# EAGLE schematic PowerSource (EAGLE 9.2.2)
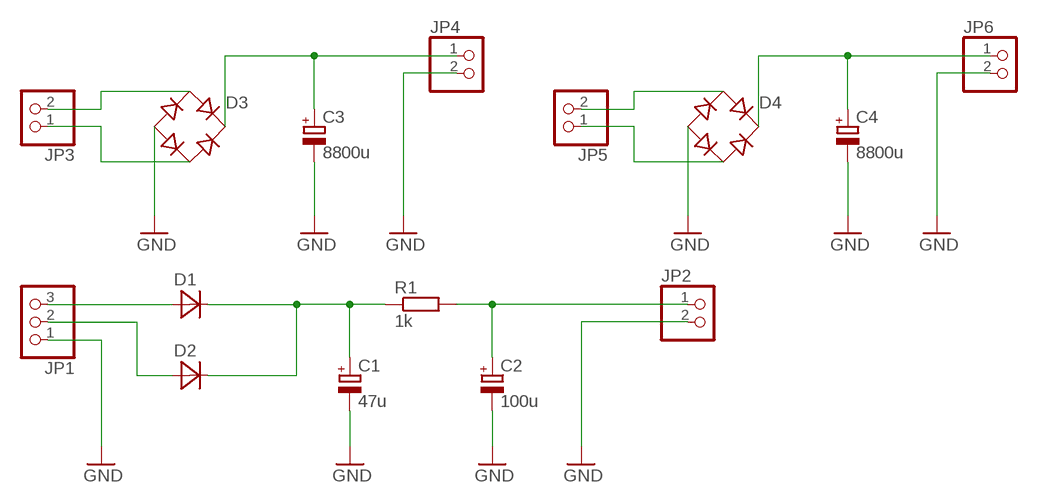
[diagram p0: schematic, sheet 1]

## Parts
C1  47u  E7.5-16  [E7,5-16]
C2  100u  E7.5-18  [E7,5-18]
C3  8800u  E7.5-18  [E7,5-18]
C4  8800u  E7.5-18  [E7,5-18]
D1  DIODE  [DO07]
D2  DIODE  [DO07]
D3  BRIDGERECTIFIER  [BRIDGERECTIFIER]
D4  BRIDGERECTIFIER  [BRIDGERECTIFIER]
JP1  PINHD-1X3  [1X03]
JP2  PINHD-1X2  [1X02]
JP3  PINHD-1X2  [1X02]
JP4  PINHD-1X2  [1X02]
JP5  PINHD-1X2  [1X02]
JP6  PINHD-1X2  [1X02]
R1  1k  RESISTOR2  [0207/7]

## Nets
GND: C1.- C2.- C3.- C4.- D3.- D4.- JP1.1 JP2.2 JP4.2 JP6.2
N$1: D2.A JP1.2
N$2: D1.A JP1.3
N$3: D3.AC1 JP3.2
N$4: D3.AC2 JP3.1
N$5: C4.+ D4.+ JP6.1
N$6: D4.AC1 JP5.2
N$7: C3.+ D3.+ JP4.1
N$8: D4.AC2 JP5.1
N$14: C2.+ JP2.1 R1.2
N$15: C1.+ D1.C D2.C R1.1

## Library data of the parts
C1 = VacuumTube:E7.5-16
C2-C4 = VacuumTube:E7.5-18
D1 D2 = VacuumTube:DIODE
D3 D4 = VacuumTube:BRIDGERECTIFIER
JP1 = VacuumTube:PINHD-1X3: PIN HEADER
JP2-JP6 = VacuumTube:PINHD-1X2: PIN HEADER
R1 = VacuumTube:RESISTOR2